# Altium schematic sheet FlashLight_Circuit.SchDoc
size A
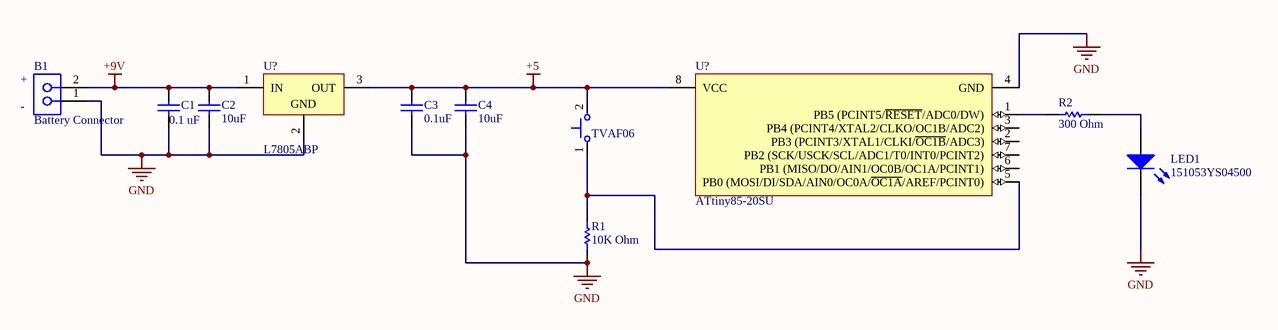
[diagram p0: FlashLight_Circuit.SchDoc]

## Parts
(Parts that share a designator on the sheet are numbered #1, #2 ... from top to bottom, then left to right.)
?  TVAF06  [JNFU-TVAF06_V]
B1  Battery Connector  [SMTC-PHF-102-01-X-S-002]
C1  0.1 uF  [CAPC2013X135X45NL10T25]
C2  10uF  [CAPC2013X135X45NL10T25]
C3  0.1uF  [CAPC2013X135X45NL10T25]
C4  10uF  [CAPC2013X135X45NL10T25]
LED1  151053YS04500  [Type 5mm]
R1  10K Ohm  [RESC2013X60X35ML10T20]
R2  300 Ohm  [RESC2013X60X35ML10T20]
U?#1  L7805ABP  [TO220FP]
U?#2  ATtiny85-20SU  [8S2_M]

## Nets
+5: ?.2 C3.2 C4.2 U?#1.3(OUT) U?#2.8(VCC)
+9V: B1.2 C1.2 C2.2 U?#1.1(IN)
GND: B1.1 C1.1 C2.1 C3.1 C4.1 LED1.1(K) R1.1 U?#1.2(GND) U?#2.4(GND)
Net?_1: ?.1 R1.2 U?#2.5(PB0_(MOSI/DI/SDA/AIN0/OC0A/~{OC1A}/AREF/PCINT0))
NetLED1_2: LED1.2(A) R2.2
NetR2_1: R2.1 U?#2.1(PB5_(PCINT5/~{RESET}/ADC0/DW))

Not connected (* = marked no-connect by the designer): U?#2 2(PB3_(PCINT3/XTAL1/CLKI/~{OC1B}/ADC3)) 3(PB4_(PCINT4/XTAL2/CLKO/OC1B/ADC2)) 6(PB1_(MISO/DO/AIN1/OC0B/OC1A/PCINT1)) 7(PB2_(SCK/USCK/SCL/ADC1/T0/INT0/PCINT2))

## Notes on the sheet
- (near B1) +
- (near B1) -

## Library data of the parts
? = CMP-0587-00001-1: Switch, SPST Push Button, 50 mA, 12 V DC, SMD, -30 to 85 degC, RoHS; Manufacturer: Jianfu; Insulation Resistance: 100 MW min. 100 V DC; Lifetime: 100000 Cycles min; Rating: 50 mA. 12 V DC; Travel: 0.13 +/- 0.05 mm; Contact Resistance: 100 mW max; Dielectric Strength: 250 V AC for 1 min; PackageReference: TVAF06; RoHS: TRUE; Operating Temperature: -30 to 85 degC; PartNumber: TVAF06; Mounting Technology: Surface Mount; ComponentLink2URL: http://en.jian-fu.com/product-22.html; ComponentLink1Description: Manufacturer URL; ComponentLink2Description: Datasheet; ComponentLink1URL: http://www.jian-fu.com/; PackageDescription: 2-Pin Switch, Push Button, SMD, Body 2.9 x 3.9 mm
B1 = CMP-1023-00103-1: Press Fit Socket, Through-hole, Vertical, -55 to 125 degC, 2.54 mm Pitch, 2-Pin, Female, RoHS; Manufacturer: Samtec; PartNumber: PHF-102-01-L-S-002; Pitch: 2.54 mm; Temperature Range: -55 to 125 degC; PackageDescription: .100 Press Fit Socket Assembly; ComponentLink1URL: http://www.samtec.com; ComponentLink1Description: Manufacturer URL; PackageReference: PHF-102-01-X-S-002; Orientation: Vertical; ComponentLink2URL: http://www.samtec.com/documents/webfiles/pdf/phf.pdf; ComponentLink3Description: Package Specification; RoHS: True; DatasheetVersion: F-214; ComponentLink2Description: Datasheet; PackageVersion: F, 9/2009; ComponentLink3URL: http://www.samtec.com/documents/webfiles/cpdf/PHF-1XX-XX-X-X-XXX-MKT.pdf; Mounting Technology: Through-hole
C1-C4 = CMP-2007-03551-1: Manufacturer: Murata; Part Number: GRM21BR71A105KA01L
LED1 = CMP-1477-00001-1: THT LED round mono-color waterclear, WL-TMRW, Yellow; Manufacturer: Wuerth Elektronik; ComponentLink2URL: http://katalog.we-online.de/pbs/datasheet/7448042001.pdfhttp://katalog.we-online.de/pbs/datasheet/7448042001.pdfhttp://katalog.we-online.de/pbs/datasheet/7448042001.pdfhttp://katalog.we-online.de/pbs/datasheet/151053YS04500.pdf; Emitting color: Yellow; PackageReference: Type 5mm; ComponentLink1URL: http://www.we-online.com; PartNumber: 151053YS04500; ComponentLink2Description: Datasheet; ComponentLink1Description: Manufacturer URL
R1 R2 = CMP-2001-01354-1: Manufacturer: Yageo; Part Number: RC0805JR-07200RL
U?#1 = CMP-0244-00479-1: Positive Voltage Regulator, 5V, 3-Pin TO-220FP; DatasheetVersion: 16/11/2011; PackageReference: TO220FP; ComponentLink1URL: http://www.st.com; PackageDescription: TO, Thru-Hole, Vertical, Heatsink Mounted; 3 In-Line Leads; Pitch 2.54 mm; ComponentLink2Description: Datasheet; PackageVersion: 2011; ComponentLink1Description: Manufacturer URL; ComponentLink2URL: http://www.st.com/internet/com/TECHNICAL_RESOURCES/TECHNICAL_LITERATURE/DATASHEET/CD00000444.pdf
U?#2 = CMP-0093-00173-2: 8-bit AVR Microcontroller, 20MHz, 2.7-5.5V, 8K Flash, 512 Bytes EEPROM, 512 Bytes SRAM, Industrial Grade (-40°C to 85°C), 8-Lead SOIC, Pb-Free; ComponentLink3Description: ATtiny25/45/85 Summary; DatasheetVersion: revN, Apr-2011; PackageVersion: revF, Apr-2008; ComponentLink3URL: http://www.atmel.com/dyn/resources/prod_documents/2586S.pdf; ComponentLink1URL: http://www.atmel.com/; ComponentLink2Description: ATtiny25/45/85 Datasheet; RevisionNote: DatasheetVersion updated. URLs added.; ComponentLink1Description: Manufacturer URL; PackageReference: 8S2; ComponentLink2URL: http://www.atmel.com/dyn/resources/prod_documents/doc2586.pdf